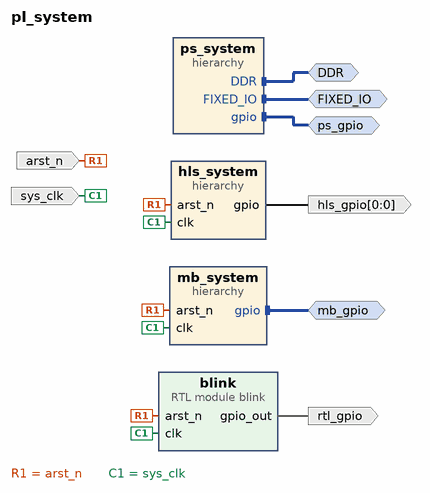
[diagram p0: block diagram of the top level]
# Vivado block design pl_system, xc7z020clg400-1, Vivado 2022.1
create_bd_design pl_system

create_bd_intf_port -mode Master -vlnv xilinx.com:interface:gpio_rtl:1.0 mb_gpio
create_bd_intf_port -mode Master -vlnv xilinx.com:interface:ddrx_rtl:1.0 DDR
create_bd_intf_port -mode Master -vlnv xilinx.com:display_processing_system7:fixedio_rtl:1.0 FIXED_IO
create_bd_intf_port -mode Master -vlnv xilinx.com:interface:gpio_rtl:1.0 ps_gpio
create_bd_port -dir I -type clk sys_clk
set_property -dict {CONFIG.ASSOCIATED_RESET arst_n CONFIG.FREQ_HZ 125000000} [get_bd_ports sys_clk]
create_bd_port -dir I -type rst arst_n
create_bd_port -dir O rtl_gpio
create_bd_port -dir O -from 0 -to 0 hls_gpio

create_bd_cell -type hier ps_system
create_bd_cell -type hier mb_system
create_bd_cell -type hier hls_system
create_bd_cell -type module -reference blink blink

# ---- hierarchy /ps_system ----
current_bd_instance /ps_system
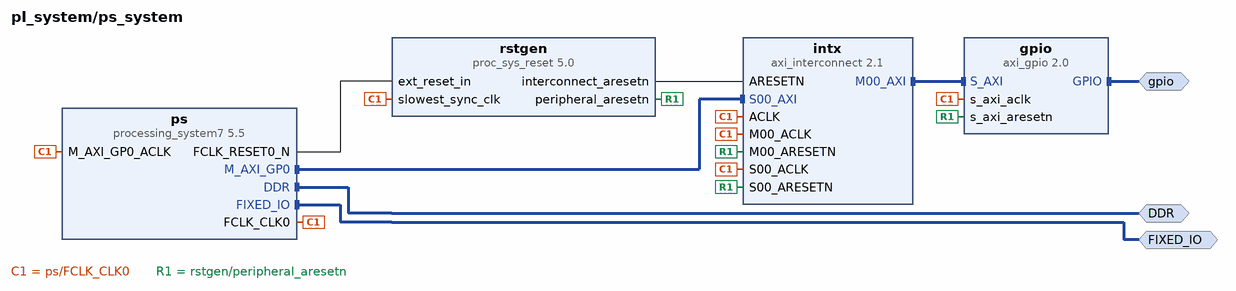
[diagram p1: block diagram inside /ps_system]
create_bd_intf_pin -mode Master -vlnv xilinx.com:interface:ddrx_rtl:1.0 DDR
create_bd_intf_pin -mode Master -vlnv xilinx.com:display_processing_system7:fixedio_rtl:1.0 FIXED_IO
create_bd_intf_pin -mode Master -vlnv xilinx.com:interface:gpio_rtl:1.0 gpio

create_bd_cell -type ip -vlnv xilinx.com:ip:proc_sys_reset:5.0 rstgen
create_bd_cell -type ip -vlnv xilinx.com:ip:processing_system7:5.5 ps
set_property -dict [list \
  CONFIG.PCW_APU_PERIPHERAL_FREQMHZ 667 \
  CONFIG.PCW_ENET0_ENET0_IO {MIO 16 .. 27} \
  CONFIG.PCW_ENET0_GRP_MDIO_ENABLE 1 \
  CONFIG.PCW_ENET0_GRP_MDIO_IO {MIO 52 .. 53} \
  CONFIG.PCW_ENET0_PERIPHERAL_ENABLE 1 \
  CONFIG.PCW_ENET0_RESET_ENABLE 0 \
  CONFIG.PCW_ENET_RESET_ENABLE 1 \
  CONFIG.PCW_ENET_RESET_SELECT {Share reset pin} \
  CONFIG.PCW_FPGA0_PERIPHERAL_FREQMHZ 50 \
  CONFIG.PCW_FPGA1_PERIPHERAL_FREQMHZ 50 \
  CONFIG.PCW_GPIO_MIO_GPIO_ENABLE 1 \
  CONFIG.PCW_GPIO_MIO_GPIO_IO MIO \
  CONFIG.PCW_I2C_RESET_ENABLE 1 \
  CONFIG.PCW_PERIPHERAL_BOARD_PRESET part0 \
  CONFIG.PCW_PRESET_BANK1_VOLTAGE {LVCMOS 1.8V} \
  CONFIG.PCW_QSPI_GRP_FBCLK_ENABLE 1 \
  CONFIG.PCW_QSPI_GRP_FBCLK_IO {MIO 8} \
  CONFIG.PCW_QSPI_GRP_SINGLE_SS_ENABLE 1 \
  CONFIG.PCW_QSPI_GRP_SINGLE_SS_IO {MIO 1 .. 6} \
  CONFIG.PCW_QSPI_PERIPHERAL_ENABLE 1 \
  CONFIG.PCW_QSPI_QSPI_IO {MIO 1 .. 6} \
  CONFIG.PCW_SD0_GRP_CD_ENABLE 1 \
  CONFIG.PCW_SD0_GRP_CD_IO {MIO 47} \
  CONFIG.PCW_SD0_GRP_WP_ENABLE 0 \
  CONFIG.PCW_SD0_PERIPHERAL_ENABLE 1 \
  CONFIG.PCW_SD0_SD0_IO {MIO 40 .. 45} \
  CONFIG.PCW_SDIO_PERIPHERAL_FREQMHZ 50 \
  CONFIG.PCW_SINGLE_QSPI_DATA_MODE x4 \
  CONFIG.PCW_UART1_PERIPHERAL_ENABLE 1 \
  CONFIG.PCW_UART1_UART1_IO {MIO 48 .. 49} \
  CONFIG.PCW_UART_PERIPHERAL_FREQMHZ 100 \
  CONFIG.PCW_UIPARAM_DDR_FREQ_MHZ 533.333333 \
  CONFIG.PCW_UIPARAM_DDR_MEMORY_TYPE {DDR 3 (Low Voltage)} \
  CONFIG.PCW_UIPARAM_DDR_PARTNO {MT41K256M16 RE-125} \
  CONFIG.PCW_USB0_PERIPHERAL_ENABLE 1 \
  CONFIG.PCW_USB0_RESET_ENABLE 1 \
  CONFIG.PCW_USB0_RESET_IO {MIO 46} \
  CONFIG.PCW_USB0_USB0_IO {MIO 28 .. 39} \
  CONFIG.PCW_USB_RESET_ENABLE 1 \
  CONFIG.PCW_USB_RESET_SELECT {Share reset pin} \
  CONFIG.preset None \
] [get_bd_cells ps]
# 498 more settings of ps are not shown: defaults, MIO pin electricals, DDR timing, and values the tool derives
create_bd_cell -type ip -vlnv xilinx.com:ip:axi_gpio:2.0 gpio
set_property -dict {CONFIG.C_ALL_OUTPUTS 1 CONFIG.C_GPIO_WIDTH 1} [get_bd_cells gpio]
create_bd_cell -type ip -vlnv xilinx.com:ip:axi_interconnect:2.1 intx
set_property -dict {CONFIG.NUM_MI 1 CONFIG.S00_HAS_REGSLICE 3} [get_bd_cells intx]

# ---- hierarchy /mb_system ----
current_bd_instance /mb_system
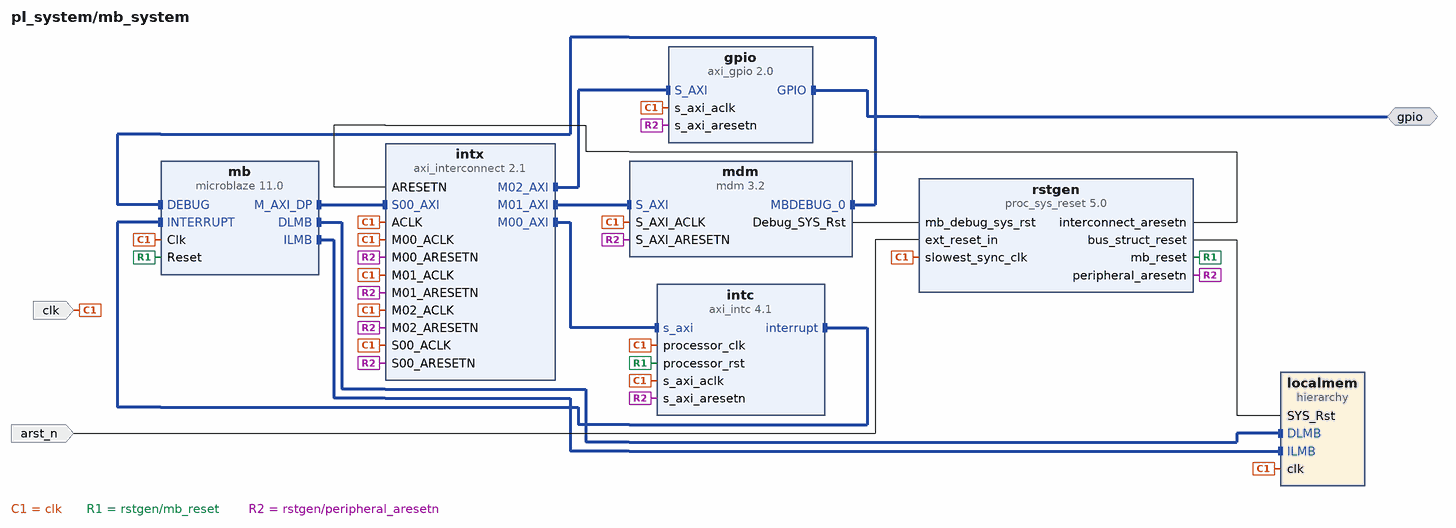
[diagram p2: block diagram inside /mb_system]
create_bd_intf_pin -mode Master -vlnv xilinx.com:interface:gpio_rtl:1.0 gpio
create_bd_pin -dir I -type clk clk
create_bd_pin -dir I -type rst arst_n

create_bd_cell -type ip -vlnv xilinx.com:ip:proc_sys_reset:5.0 rstgen
create_bd_cell -type hier localmem
create_bd_cell -type ip -vlnv xilinx.com:ip:axi_gpio:2.0 gpio
set_property -dict {CONFIG.C_ALL_INPUTS 0 CONFIG.C_ALL_OUTPUTS 1 CONFIG.C_GPIO_WIDTH 1} [get_bd_cells gpio]
create_bd_cell -type ip -vlnv xilinx.com:ip:microblaze:11.0 mb
set_property -dict [list \
  CONFIG.C_ADDR_TAG_BITS 0 \
  CONFIG.C_AREA_OPTIMIZED 1 \
  CONFIG.C_DCACHE_ADDR_TAG 0 \
  CONFIG.C_DEBUG_ENABLED 1 \
  CONFIG.C_D_AXI 1 \
  CONFIG.C_D_LMB 1 \
  CONFIG.C_I_LMB 1 \
  CONFIG.C_USE_BARREL 1 \
  CONFIG.C_USE_HW_MUL 1 \
  CONFIG.C_USE_MSR_INSTR 1 \
  CONFIG.C_USE_PCMP_INSTR 1 \
  CONFIG.C_USE_REORDER_INSTR 0 \
  CONFIG.G_TEMPLATE_LIST 8 \
] [get_bd_cells mb]
create_bd_cell -type ip -vlnv xilinx.com:ip:axi_intc:4.1 intc
set_property -dict {CONFIG.C_HAS_FAST 1} [get_bd_cells intc]
create_bd_cell -type ip -vlnv xilinx.com:ip:mdm:3.2 mdm
set_property -dict {CONFIG.C_ADDR_SIZE 32 CONFIG.C_M_AXI_ADDR_WIDTH 32 CONFIG.C_USE_UART 1} [get_bd_cells mdm]
create_bd_cell -type ip -vlnv xilinx.com:ip:axi_interconnect:2.1 intx
set_property -dict {CONFIG.NUM_MI 3 CONFIG.S00_HAS_REGSLICE 3 CONFIG.STRATEGY 1} [get_bd_cells intx]

# ---- hierarchy /mb_system/localmem ----
current_bd_instance /mb_system/localmem
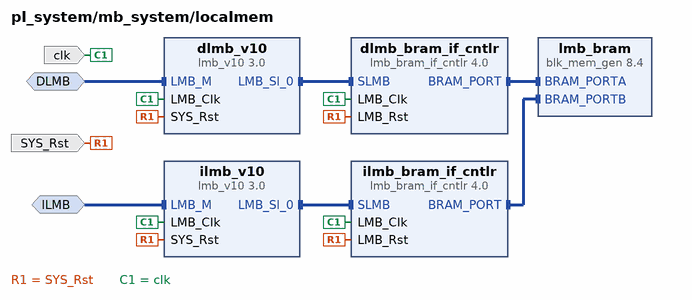
[diagram p3: block diagram inside /mb_system/localmem]
create_bd_intf_pin -mode MirroredMaster -vlnv xilinx.com:interface:lmb_rtl:1.0 ILMB
create_bd_intf_pin -mode MirroredMaster -vlnv xilinx.com:interface:lmb_rtl:1.0 DLMB
create_bd_pin -dir I -type rst SYS_Rst
create_bd_pin -dir I -type clk clk

create_bd_cell -type ip -vlnv xilinx.com:ip:lmb_v10:3.0 ilmb_v10
create_bd_cell -type ip -vlnv xilinx.com:ip:lmb_bram_if_cntlr:4.0 ilmb_bram_if_cntlr
set_property -dict {CONFIG.C_ECC 0} [get_bd_cells ilmb_bram_if_cntlr]
create_bd_cell -type ip -vlnv xilinx.com:ip:blk_mem_gen:8.4 lmb_bram
set_property -dict [list \
  CONFIG.Enable_B Use_ENB_Pin \
  CONFIG.Memory_Type True_Dual_Port_RAM \
  CONFIG.Port_B_Clock 100 \
  CONFIG.Port_B_Enable_Rate 100 \
  CONFIG.Port_B_Write_Rate 50 \
  CONFIG.Use_RSTB_Pin true \
  CONFIG.use_bram_block BRAM_Controller \
] [get_bd_cells lmb_bram]
create_bd_cell -type ip -vlnv xilinx.com:ip:lmb_bram_if_cntlr:4.0 dlmb_bram_if_cntlr
set_property -dict {CONFIG.C_ECC 0} [get_bd_cells dlmb_bram_if_cntlr]
create_bd_cell -type ip -vlnv xilinx.com:ip:lmb_v10:3.0 dlmb_v10

# ---- hierarchy /hls_system ----
current_bd_instance /hls_system
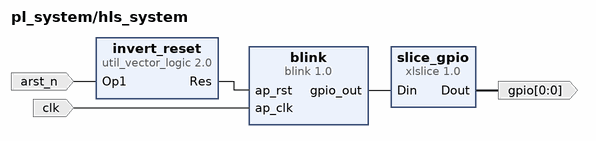
[diagram p4: block diagram inside /hls_system]
create_bd_pin -dir I -type clk clk
create_bd_pin -dir I -type rst arst_n
create_bd_pin -dir O -from 0 -to 0 gpio

create_bd_cell -type ip -vlnv xilinx.com:ip:util_vector_logic:2.0 invert_reset
set_property -dict {CONFIG.C_OPERATION not CONFIG.C_SIZE 1} [get_bd_cells invert_reset]
create_bd_cell -type ip -vlnv xilinx.com:ip:xlslice:1.0 slice_gpio
create_bd_cell -type ip -vlnv xilinx.com:hls:blink:1.0 blink

# ---- connections ----

current_bd_instance /ps_system
connect_bd_intf_net [get_bd_intf_pins gpio] [get_bd_intf_pins gpio/GPIO]
connect_bd_intf_net [get_bd_intf_pins gpio/S_AXI] [get_bd_intf_pins intx/M00_AXI]
connect_bd_intf_net [get_bd_intf_pins DDR] [get_bd_intf_pins ps/DDR]
connect_bd_intf_net [get_bd_intf_pins FIXED_IO] [get_bd_intf_pins ps/FIXED_IO]
connect_bd_intf_net [get_bd_intf_pins ps/M_AXI_GP0] [get_bd_intf_pins intx/S00_AXI]
connect_bd_net [get_bd_pins ps/FCLK_CLK0] \
  [get_bd_pins rstgen/slowest_sync_clk] [get_bd_pins ps/M_AXI_GP0_ACLK] [get_bd_pins gpio/s_axi_aclk] \
  [get_bd_pins intx/S00_ACLK] [get_bd_pins intx/M00_ACLK] [get_bd_pins intx/ACLK]
connect_bd_net [get_bd_pins ps/FCLK_RESET0_N] [get_bd_pins rstgen/ext_reset_in]
connect_bd_net [get_bd_pins rstgen/interconnect_aresetn] [get_bd_pins intx/ARESETN]
connect_bd_net [get_bd_pins rstgen/peripheral_aresetn] [get_bd_pins gpio/s_axi_aresetn] [get_bd_pins intx/M00_ARESETN] [get_bd_pins intx/S00_ARESETN]

current_bd_instance /mb_system
connect_bd_intf_net [get_bd_intf_pins gpio] [get_bd_intf_pins gpio/GPIO]
connect_bd_intf_net [get_bd_intf_pins intc/interrupt] [get_bd_intf_pins mb/INTERRUPT]
connect_bd_intf_net [get_bd_intf_pins intx/M00_AXI] [get_bd_intf_pins intc/s_axi]
connect_bd_intf_net [get_bd_intf_pins intx/M01_AXI] [get_bd_intf_pins mdm/S_AXI]
connect_bd_intf_net [get_bd_intf_pins intx/M02_AXI] [get_bd_intf_pins gpio/S_AXI]
connect_bd_intf_net [get_bd_intf_pins mb/DLMB] [get_bd_intf_pins localmem/DLMB]
connect_bd_intf_net [get_bd_intf_pins mb/ILMB] [get_bd_intf_pins localmem/ILMB]
connect_bd_intf_net [get_bd_intf_pins mb/M_AXI_DP] [get_bd_intf_pins intx/S00_AXI]
connect_bd_intf_net [get_bd_intf_pins mdm/MBDEBUG_0] [get_bd_intf_pins mb/DEBUG]
connect_bd_net [get_bd_pins arst_n] [get_bd_pins rstgen/ext_reset_in]
connect_bd_net [get_bd_pins clk] \
  [get_bd_pins rstgen/slowest_sync_clk] [get_bd_pins localmem/clk] [get_bd_pins gpio/s_axi_aclk] [get_bd_pins mb/Clk] \
  [get_bd_pins intc/s_axi_aclk] [get_bd_pins intc/processor_clk] [get_bd_pins mdm/S_AXI_ACLK] [get_bd_pins intx/ACLK] \
  [get_bd_pins intx/M00_ACLK] [get_bd_pins intx/S00_ACLK] [get_bd_pins intx/M01_ACLK] [get_bd_pins intx/M02_ACLK]
connect_bd_net [get_bd_pins mdm/Debug_SYS_Rst] [get_bd_pins rstgen/mb_debug_sys_rst]
connect_bd_net [get_bd_pins rstgen/bus_struct_reset] [get_bd_pins localmem/SYS_Rst]
connect_bd_net [get_bd_pins rstgen/interconnect_aresetn] [get_bd_pins intx/ARESETN]
connect_bd_net [get_bd_pins rstgen/mb_reset] [get_bd_pins mb/Reset] [get_bd_pins intc/processor_rst]
connect_bd_net [get_bd_pins rstgen/peripheral_aresetn] \
  [get_bd_pins gpio/s_axi_aresetn] [get_bd_pins intc/s_axi_aresetn] [get_bd_pins mdm/S_AXI_ARESETN] \
  [get_bd_pins intx/S00_ARESETN] [get_bd_pins intx/M00_ARESETN] [get_bd_pins intx/M01_ARESETN] [get_bd_pins intx/M02_ARESETN]
set_property HDL_ATTRIBUTE.BMM_INFO_PROCESSOR {microblaze-le > pl_system mb_system/localmem/dlmb_bram_if_cntlr} [get_bd_cells mb]
set_property HDL_ATTRIBUTE.KEEP_HIERARCHY yes [get_bd_cells mb]

current_bd_instance /mb_system/localmem
connect_bd_intf_net -intf_net microblaze_0_dlmb [get_bd_intf_pins DLMB] [get_bd_intf_pins dlmb_v10/LMB_M]
connect_bd_intf_net -intf_net microblaze_0_dlmb_bus [get_bd_intf_pins dlmb_v10/LMB_Sl_0] [get_bd_intf_pins dlmb_bram_if_cntlr/SLMB]
connect_bd_intf_net -intf_net microblaze_0_dlmb_cntlr [get_bd_intf_pins dlmb_bram_if_cntlr/BRAM_PORT] [get_bd_intf_pins lmb_bram/BRAM_PORTA]
connect_bd_intf_net -intf_net microblaze_0_ilmb [get_bd_intf_pins ILMB] [get_bd_intf_pins ilmb_v10/LMB_M]
connect_bd_intf_net -intf_net microblaze_0_ilmb_bus [get_bd_intf_pins ilmb_v10/LMB_Sl_0] [get_bd_intf_pins ilmb_bram_if_cntlr/SLMB]
connect_bd_intf_net -intf_net microblaze_0_ilmb_cntlr [get_bd_intf_pins ilmb_bram_if_cntlr/BRAM_PORT] [get_bd_intf_pins lmb_bram/BRAM_PORTB]
connect_bd_net [get_bd_pins SYS_Rst] \
  [get_bd_pins ilmb_v10/SYS_Rst] [get_bd_pins ilmb_bram_if_cntlr/LMB_Rst] [get_bd_pins dlmb_bram_if_cntlr/LMB_Rst] \
  [get_bd_pins dlmb_v10/SYS_Rst]
connect_bd_net -net microblaze_0_Clk [get_bd_pins clk] \
  [get_bd_pins ilmb_v10/LMB_Clk] [get_bd_pins ilmb_bram_if_cntlr/LMB_Clk] [get_bd_pins dlmb_bram_if_cntlr/LMB_Clk] \
  [get_bd_pins dlmb_v10/LMB_Clk]
set_property HDL_ATTRIBUTE.BMM_INFO_ADDRESS_SPACE {byte  0x00000000 32 > pl_system mb_system/localmem/lmb_bram} [get_bd_cells dlmb_bram_if_cntlr]
set_property HDL_ATTRIBUTE.KEEP_HIERARCHY yes [get_bd_cells dlmb_bram_if_cntlr]

current_bd_instance /hls_system
connect_bd_net [get_bd_pins arst_n] [get_bd_pins invert_reset/Op1]
connect_bd_net [get_bd_pins blink/gpio_out] [get_bd_pins slice_gpio/Din]
connect_bd_net [get_bd_pins clk] [get_bd_pins blink/ap_clk]
connect_bd_net [get_bd_pins invert_reset/Res] [get_bd_pins blink/ap_rst]
connect_bd_net [get_bd_pins slice_gpio/Dout] [get_bd_pins gpio]

current_bd_instance /
connect_bd_intf_net [get_bd_intf_ports DDR] [get_bd_intf_pins ps_system/DDR]
connect_bd_intf_net [get_bd_intf_ports FIXED_IO] [get_bd_intf_pins ps_system/FIXED_IO]
connect_bd_intf_net [get_bd_intf_ports mb_gpio] [get_bd_intf_pins mb_system/gpio]
connect_bd_intf_net [get_bd_intf_ports ps_gpio] [get_bd_intf_pins ps_system/gpio]
connect_bd_net [get_bd_ports arst_n] [get_bd_pins mb_system/arst_n] [get_bd_pins hls_system/arst_n] [get_bd_pins blink/arst_n]
connect_bd_net -net hls_gpio [get_bd_pins hls_system/gpio] [get_bd_ports hls_gpio]
connect_bd_net -net rtl_gpio [get_bd_pins blink/gpio_out] [get_bd_ports rtl_gpio]
connect_bd_net [get_bd_ports sys_clk] [get_bd_pins mb_system/clk] [get_bd_pins hls_system/clk] [get_bd_pins blink/clk]

# ---- address map ----
assign_bd_address -offset 0x00000000 -range 64K -target_address_space [get_bd_addr_spaces mb_system/mb/Data] [get_bd_addr_segs mb_system/localmem/dlmb_bram_if_cntlr/SLMB/Mem]
assign_bd_address -offset 0x00040000 -range 4K -target_address_space [get_bd_addr_spaces mb_system/mb/Data] [get_bd_addr_segs mb_system/intc/S_AXI/Reg]
assign_bd_address -offset 0x00050000 -range 4K -target_address_space [get_bd_addr_spaces mb_system/mb/Data] [get_bd_addr_segs mb_system/mdm/S_AXI/Reg]
assign_bd_address -offset 0x00080000 -range 4K -target_address_space [get_bd_addr_spaces mb_system/mb/Data] [get_bd_addr_segs mb_system/gpio/S_AXI/Reg]
assign_bd_address -offset 0x00000000 -range 64K -target_address_space [get_bd_addr_spaces mb_system/mb/Instruction] [get_bd_addr_segs mb_system/localmem/ilmb_bram_if_cntlr/SLMB/Mem]
assign_bd_address -offset 0x40000000 -range 4K -target_address_space [get_bd_addr_spaces ps_system/ps/Data] [get_bd_addr_segs ps_system/gpio/S_AXI/Reg]

validate_bd_design
save_bd_design
